# Altium schematic sheet Power.SchDoc
size A4; SheetNumber: 3; SheetTotal: 3
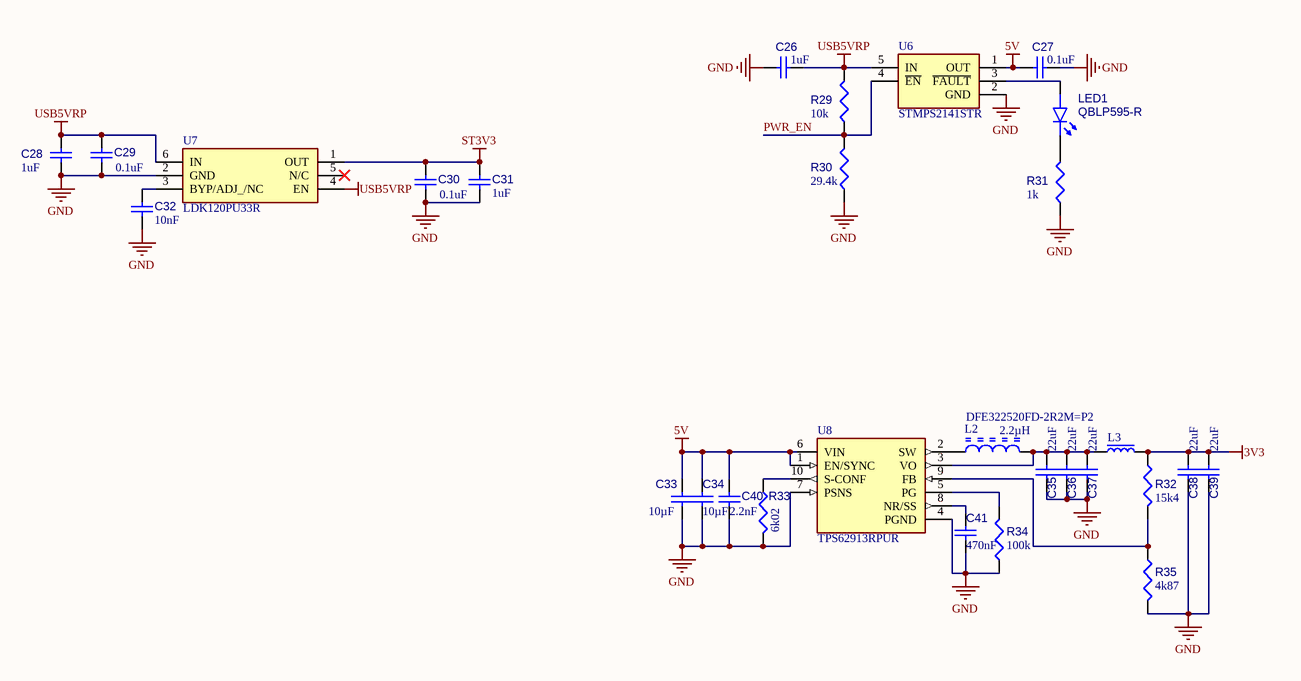
[diagram p0: Power.SchDoc]

## Parts
C26  value 1uF  [CAPC1005X55X25ML05T05]  (hidden comment: Capacitor 10 pF +/- 5% 50 V 0402)
C27  value 0.1uF  [CAPC1005X55X25ML05T05]  (hidden comment: Capacitor 10 pF +/- 5% 50 V 0402)
C28  value 1uF  [CAPC1005X55X25ML05T05]  (hidden comment: Capacitor 10 pF +/- 5% 50 V 0402)
C29  value 0.1uF  [CAPC1005X55X25ML05T05]  (hidden comment: Capacitor 10 pF +/- 5% 50 V 0402)
C30  value 0.1uF  [CAPC1005X55X25ML05T05]  (hidden comment: Capacitor 10 pF +/- 5% 50 V 0402)
C31  value 1uF  [CAPC1005X55X25ML05T05]  (hidden comment: Capacitor 10 pF +/- 5% 50 V 0402)
C32  value 10nF  [CAPC1005X55X25ML05T05]  (hidden comment: Capacitor 10 pF +/- 5% 50 V 0402)
C33  value 10µF  [CAPC2013X135X45NL10T25]  (hidden comment: Capacitor 1 uF +/- 10% 50 V 0805)
C34  value 10µF  [CAPC2013X135X45NL10T25]  (hidden comment: Capacitor 1 uF +/- 10% 50 V 0805)
C35  value 22uF  [CAPC3216X180X50ML20T25]  (hidden comment: Capacitor 10 uF +/- 10% 16 V 1206)
C36  value 22uF  [CAPC3216X180X50ML20T25]  (hidden comment: Capacitor 10 uF +/- 10% 16 V 1206)
C37  value 22uF  [CAPC3216X180X50ML20T25]  (hidden comment: Capacitor 10 uF +/- 10% 16 V 1206)
C38  value 22uF  [CAPC3216X180X50ML20T25]  (hidden comment: Capacitor 10 uF +/- 10% 16 V 1206)
C39  value 22uF  [CAPC3216X180X50ML20T25]  (hidden comment: Capacitor 10 uF +/- 10% 16 V 1206)
C40  value 2.2nF  [CAPC1005X55X25ML05T05]  (hidden comment: Capacitor 10 pF +/- 5% 50 V 0402)
C41  value 470nF  [CAPC1005X55X25ML05T05]  (hidden comment: Capacitor 10 pF +/- 5% 50 V 0402)
L2  DFE322520FD-2R2M=P2  Inductance: 2.2µH  [BOUR-CM322522_V]
L3  FB_0603  [FB_0603]  (value not drawn)
LED1  QBLP595-R  [QTB-QBLP595_V]
R29  value 10k  [RESC1005X40X25ML10T10]  (hidden comment: Resistor 15k +/-1% 0402 63 mW)
R30  value 29.4k  [RESC1005X40X25ML10T10]  (hidden comment: Resistor 15k +/-1% 0402 63 mW)
R31  value 1k  [RESC1005X40X25ML10T10]  (hidden comment: Resistor 15k +/-1% 0402 63 mW)
R32  value 15k4  [RESC1005X40X25ML10T10]  (hidden comment: Resistor 15k +/-1% 0402 63 mW)
R33  value 6k02  [RESC1005X40X25ML10T10]  (hidden comment: Resistor 15k +/-1% 0402 63 mW)
R34  value 100k  [RESC1005X40X25ML10T10]  (hidden comment: Resistor 15k +/-1% 0402 63 mW)
R35  value 4k87  [RESC1005X40X25ML10T10]  (hidden comment: Resistor 15k +/-1% 0402 63 mW)
U6  STMPS2141STR  [FP-SOT23-5L-IPC_C]
U7  LDK120PU33R  [LDK120PU33R]
U8  TPS62913RPUR  [FP-RPU0010A-MFG]

## Nets
3V3: C38.2 C39.2 L3.2 R32.1
5V: C27.1 C33.2 C34.2 C40.2 U6.1(OUT) U8.1(EN/SYNC) U8.6(VIN)
GND: C26.1 C27.2 C28.1 C29.1 C30.1 C31.2 C32.1 C33.1 C34.1 C35.1 C36.1 C37.1 C38.1 C39.1 C40.1 C41.1 R30.1 R31.1 R33.2 R34.2 R35.2 U6.2(GND) U7.2(GND) U8.4(PGND) U8.7(PSNS)
ST3V3: C30.2 C31.1 U7.1(OUT)
USB5VRP: C26.2 C28.2 C29.2 R29.2 U6.5(IN) U7.4(EN) U7.6(IN)
PWR_EN: R29.1 R30.2 U6.4(~{EN})
NetC32_2: C32.2 U7.3(BYP/ADJ_/NC)
NetC35_2: C35.2 C36.2 C37.2 L2.2 L3.1 U8.3(VO)
NetC41_2: C41.2 U8.8(NR/SS)
NetL2_1: L2.1 U8.2(SW)
NetLED1_1: LED1.1(K) R31.2
NetLED1_2: LED1.2(A) U6.3(~{FAULT})
NetR32_2: R32.2 R35.1 U8.9(FB)
NetR33_1: R33.1 U8.10(S-CONF)
NetR34_1: R34.1 U8.5(PG)

Not connected (* = marked no-connect by the designer): U7 5(N/C)*

## Library data of the parts
C26-C32 C40 C41 = CMP-001-00013-6: Chip Capacitor, 10 pF, +/- 5%, 50 V, 0402 (1005 Metric); Capacitor Type: Ceramic; Voltage Rating: 50V; Max Operating Temperature: 125°C; Pins: 2; Mounting Technology: SM; Tolerance: 5%; RoHS Compliant: True; Case/Package: 0402; Min Operating Temperature: -55°C
C33 C34 = CMP-001-00007-7: Chip Capacitor, 1 uF, +/- 10%, 50 V, 0805 (2012 Metric); Voltage Rating: 50V; Capacitor Type: Ceramic; RoHS Compliant: True; Case/Package: 0805; Tolerance: 10%; Min Operating Temperature: -55°C; Max Operating Temperature: 125°C; Pins: 2; Mounting Technology: SM
C35-C39 = CMP-001-00016-6: Chip Capacitor, 10 uF, +/- 10%, 16 V, 1206 (3216 Metric); Capacitor Type: Ceramic; Voltage Rating: 16V; Tolerance: 10%; Min Operating Temperature: -55°C; Pins: 2; Mounting Technology: SM; Case/Package: 1206; Max Operating Temperature: 125°C; RoHS Compliant: True
L2 = CMP-006-00005-3: Chip Inductor, 2.2 uH, +/- 10%, -40 to 125 degC, 1210 (3225 Metric), RoHS, Tape and Reel; Manufacturer: Bourns; Current Rating: 140mA; Q Factor: 30; Self Resonant Frequency: 30MHz; Core Material: Ferrite; Shielding: Unshielded; Resistance: 2.1Ohm; Mounting Technology: SM; Min Operating Temperature: -20°C; Datasheet URL: http://www.murata.com/~/media/webrenewal/support/library/catalog/products/emc/emifil/c30e.ashx?la=en-gb; Case/Package: 1210; Pins: 2; Package Description: 2-Pin Surface Mount Device, Body 3.2 x 2.5 mm; RoHS Compliant: True; Max Operating Temperature: 100°C; Inductance Tolerance: 10%; Package Reference: 1210; Packaging: TapeandReel; Package Quantity: 1; Datasheet Version: Aug-14; Tolerance: 10%
L3 = CMP-006-00022-1: Ferrite Bead SMD 0603 BLE18PS080SN1D Murata; Design Item ID: FB_0603; Source: Schematic-Lib-PhilsLab.SchLib; Manufacturer Part Number: *; LCSC: *; Distributor Link: *; Manufacturer: *
LED1 = CMP-007-00040-3: Chip LED 0402, Red, 0.02 A, 2.0 to 2.5 V, -40 to 80 degC, 2-Pin SMD, RoHS, Tape and Reel; Colour: Red; RoHS Compliant: Yes; Case/Package: 0402; Pins: 2; Mounting Technology: SMT
R29-R35 = CMP-009-00026-5: Chip Resistor, 15 KOhm, +/- 1%, 0.063 W, -55 to 155 degC, 0402 (1005 Metric); Power: 63mW; Min Operating Temperature: -55°C; Tolerance: 1%; Max Operating Temperature: 155°C; Mounting Technology: SM; Case/Package: 0402; RoHS Compliant: True; Pins: 2
U6 = CMP-016-00010-4: Buffer/Inverter Based Peripheral Driver, 1 Driver, PDSO5; Min Supply Voltage: 2.7V; Max Supply Voltage: 5.5V; Nominal Supply Voltage: 5V; Min Operating Temperature: -40°C; Max Operating Temperature: 85°C; Case/Package: LSSOP; Pins: 5; RoHS Compliant: Yes
U7 = CMP-040-000000-3: STMicroelectronics LDK120PU33R, LDO Voltage Regulator, 200mA, 3.3 V +/-3%, 1.9  5.5 Vin, 6-Pin DFN; Geometry.Height: 0.5mm; Mouser Price/Stock: https://www.mouser.com/Search/Refine.aspx?Keyword=511-LDK120PU33R; Mouser Part Number: 511-LDK120PU33R; Manufacturer_Part_Number: LDK120PU33R; Source: LDK120PU33R.SchLib; Datasheet Link: https://componentsearchengine.com/Datasheets/1/LDK120PU33R.pdf; Design Item ID: LDK120PU33R; Manufacturer_Name: STMicroelectronics
U8 = CMP-019-00052-1: Switching Regulator, Current-mode, 2A, 2420kHz Switching Freq-Max; RoHS Compliant: Yes